# EAGLE design controller (EAGLE 6.1)
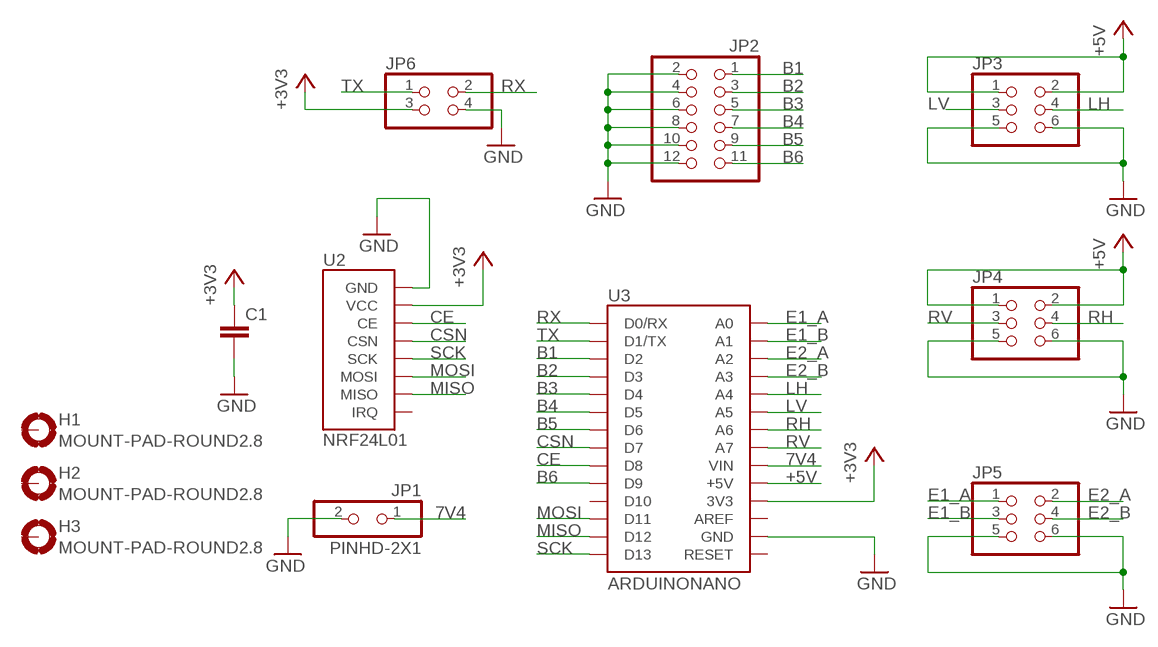
[diagram p0: schematic, sheet 1]

## Parts
C1  C-EUC0805  [C0805]
H1  MOUNT-PAD-ROUND2.8  [2,8-PAD]
H2  MOUNT-PAD-ROUND2.8  [2,8-PAD]
H3  MOUNT-PAD-ROUND2.8  [2,8-PAD]
JP1  PINHD-2X1  [2X01/90]
JP2  PINHD-2X6/90  [2X06/90]
JP3  PINHD-2X3/90  [2X03/90]
JP4  PINHD-2X3/90  [2X03/90]
JP5  PINHD-2X3/90  [2X03/90]
JP6  PINHD-2X2/90  [2X02/90]
U2  NRF24L01  [NRF24L01]
U3  ARDUINONANO  [PDIP-32]

## Nets
7V4: JP1.1 U3.VIN
+3V3: C1.1 JP6.3 U2.2(VCC) U3.3V3
+5V: JP3.1 JP3.2 JP4.1 JP4.2 U3.+5V
B1: JP2.1 U3.D2
B2: JP2.3 U3.D3
B3: JP2.5 U3.D4
B4: JP2.7 U3.D5
B5: JP2.9 U3.D6
B6: JP2.11 U3.D9
CE: U2.3(CE) U3.D8
CSN: U2.4(CSN) U3.D7
E1_A: JP5.1 U3.A0
E1_B: JP5.3 U3.A1
E2_A: JP5.2 U3.A2
E2_B: JP5.4 U3.A3
GND: C1.2 JP1.2 JP2.2 JP2.4 JP2.6 JP2.8 JP2.10 JP2.12 JP3.5 JP3.6 JP4.5 JP4.6 JP5.5 JP5.6 JP6.4 U2.1(GND) U3.GND U3.GND1(GND)
LH: JP3.4 U3.A4
LV: JP3.3 U3.A5
MISO: U2.7(MISO) U3.D12
MOSI: U2.6(MOSI) U3.D11
RH: JP4.4 U3.A6
RV: JP4.3 U3.A7
RX: JP6.2 U3.D0/RX
SCK: U2.5(SCK) U3.D13
TX: JP6.1 U3.D1/TX
Unconnected: H1.B2,8(MOUNT) H2.B2,8(MOUNT) H3.B2,8(MOUNT) U2.8(IRQ) U3.AREF U3.D10 U3.RESET U3.RESET1(RESET)

## Library data of the parts
C1 = rcl:C-EU: CAPACITOR, European symbol
H1-H3 = holes:MOUNT-PAD-ROUND: MOUNTING PAD, round
JP1 = pinhead:PINHD-2X1
JP2 = pinhead:PINHD-2X6: PIN HEADER
JP3-JP5 = pinhead:PINHD-2X3: PIN HEADER
JP6 = pinhead:PINHD-2X2: PIN HEADER
U2 = RF:NRF24L01
U3 = jet-lib:ARDUINONANO

## Board
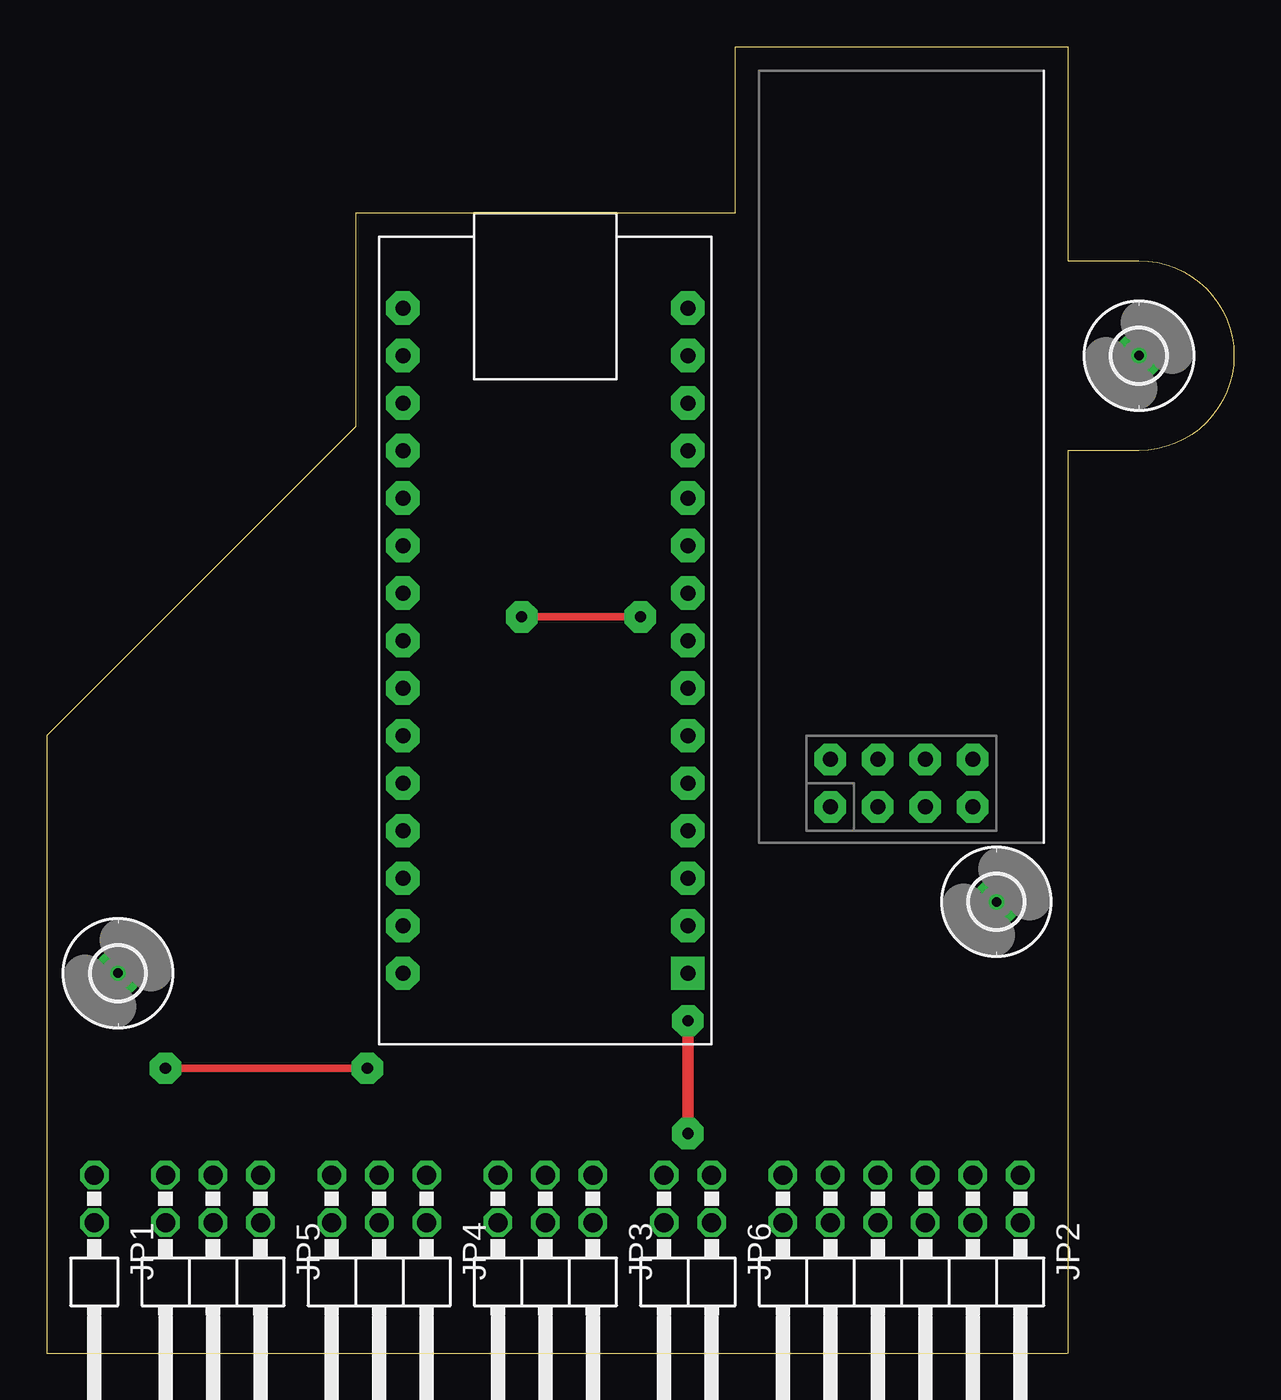
[diagram p1: board, top side]
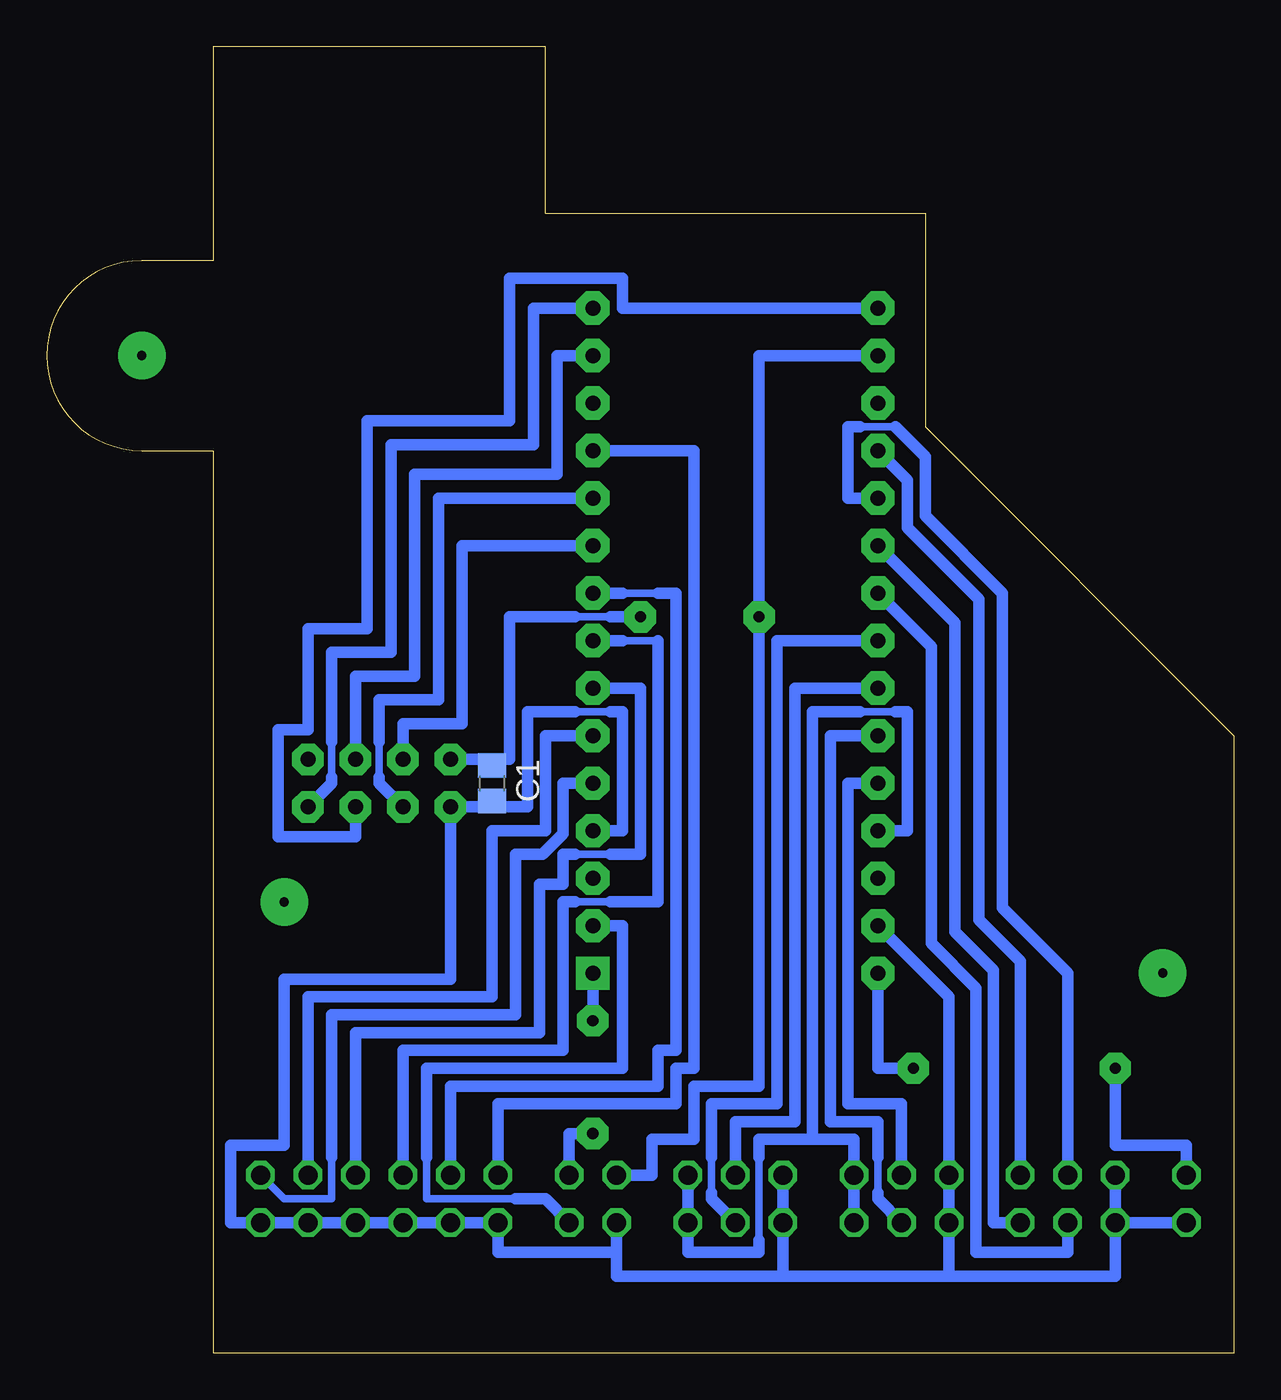
[diagram p2: board, bottom side, seen from below]

Size 63.5 x 69.85 mm. Coordinates in mm from the lower left corner, seen from the top.
Outline: 54.59,0 0,0 0,33.02 16.51,49.53 16.51,60.96 36.83,60.96 36.83,69.85 54.61,69.85 54.61,58.42 58.42,58.42 arc-180 58.42,48.26 54.61,48.26 54.61,0
Copper layers (1*16): Top 0.035mm / dielectric 1.5mm / Bottom 0.035mm
Design rules: minimum track width 10mil, minimum drill 24mil, track to track 8mil, track to pad 8mil, pad to pad 8mil, via to via 8mil, smd to smd 8mil, copper to edge 40mil, drill to drill 8mil, minimum pad ring 10mil, minimum via ring 8mil, stop-mask expansion 4mil, vias tented up to drill 0mil, thermal gap 10mil

### Footprints (pad centres in the part's own frame; a part is rotated, then mirrored left to right if it is on the bottom)
C0805 = smd 1.3 x 1.5: 1 -0.95,0; 2 0.95,0
2,8-PAD = drill 0.5 pad 2.54: B2,8 0,0
2X01/90 = drill 1.016 octagon: 1 0,-6.35; 2 0,-3.81
2X06/90 = drill 1.016 octagon: 1 -6.35,-6.35; 2 -6.35,-3.81; 3 -3.81,-6.35; 4 -3.81,-3.81; 5 -1.27,-6.35; 6 -1.27,-3.81; 7 1.27,-6.35; 8 1.27,-3.81; 9 3.81,-6.35; 10 3.81,-3.81; 11 6.35,-6.35; 12 6.35,-3.81
2X03/90 = drill 1.016 octagon: 1 -2.54,-6.35; 2 -2.54,-3.81; 3 0,-6.35; 4 0,-3.81; 5 2.54,-6.35; 6 2.54,-3.81
2X02/90 = drill 1.016 octagon: 1 -1.27,-6.35; 2 -1.27,-3.81; 3 1.27,-6.35; 4 1.27,-3.81
NRF24L01 = drill 0.8 pad 1.676 octagon: 1 19.05,-3.81; 2 16.51,-3.81; 3 19.05,-1.27; 4 16.51,-1.27; 5 19.05,1.27; 6 16.51,1.27; 7 19.05,3.81; 8 16.51,3.81
PDIP-32 = drill 0.8 pad 1.778 octagon: 3V3 15.24,-35.56; +5V 15.24,-10.16; A0 15.24,-30.48; A1 15.24,-27.94; A2 15.24,-25.4; A3 15.24,-22.86; A4 15.24,-20.32; A5 15.24,-17.78; A6 15.24,-15.24; A7 15.24,-12.7; AREF 15.24,-33.02; D0/RX 0,-5.08; D2 0,-12.7; D3 0,-15.24; D4 0,-17.78; D5 0,-20.32; D6 0,-22.86; D7 0,-25.4; D8 0,-27.94; D9 0,-30.48; D10 0,-33.02; D11 0,-35.56; D12 0,-38.1; D13 15.24,-38.1; GND 0,-10.16; GND1 15.24,-5.08; RESET 0,-7.62; RESET1 15.24,-7.62; VIN 15.24,-2.54 | drill 0.8 pad 1.778 square: D1/TX 0,-2.54

### Placement (x,y rotation side)
C1  39.69,30.48 270 bottom
H1  3.81,20.32 0 top
H2  50.8,24.13 0 top
H3  58.42,53.34 0 top
JP1  2.54,3.17 180 top
JP2  45.72,3.17 180 top
JP3  26.67,3.17 180 top
JP4  17.78,3.17 180 top
JP5  8.89,3.17 180 top
JP6  34.29,3.17 180 top
U2  45.72,48.26 270 top
U3  34.29,17.78 180 top

### Tracks (layer width: path | path; a pad name or v marks a point on that pad's centre or on a via)
7V4  (via drill 0.6 pad 1.68)
  Top 0.406: v6.35,15.24 v17.14,15.24
  Bottom 0.61: JP1.1 2.54,11.11 6.35,11.11 v6.35,15.24 | v17.14,15.24 19.05,15.24 U3.VIN
+3V3  (via drill 0.6 pad 1.68)
  Top 0.406: v31.75,39.37 v25.4,39.37
  Bottom 0.406: 35.24,39.37 33.34,39.37
  Bottom 0.61: U3.3V3 25.4,53.34 v25.4,39.37 25.4,14.29 28.89,14.29 28.89,11.43 31.11,11.43 31.11,9.53 JP6.3 | 35.24,39.37 38.73,39.37 38.73,31.75 39.69,31.75 | 33.34,39.37 v31.75,39.37 | C1.1 39.69,31.75 | 39.69,31.75 U2.2
+5V
  Bottom 0.406: 18.1,34.29 20,34.29 | 25.4,10.48 25.4,6.03
  Bottom 0.61: 22.54,11.43 25.4,11.43 25.4,10.48 | U3.+5V 17.46,27.94 17.46,34.29 18.1,34.29 | 20,34.29 22.54,34.29 22.54,11.43 | 22.54,11.43 20.32,11.43 JP4.1 JP4.2 | JP3.1 JP3.2 29.21,5.4 25.4,5.4 25.4,6.03
B1
  Bottom 0.406: 48.26,10.48 48.26,8.26 50.8,8.26 JP2.1
  Bottom 0.61: U3.D2 35.88,30.48 35.88,27.78 36.99,26.67 38.42,26.67 38.42,18.1 48.26,18.1 48.26,10.48
B2
  Bottom 0.61: U3.D3 36.83,33.02 36.83,27.94 39.69,27.94 39.69,19.05 49.53,19.05 JP2.3
B3
  Bottom 0.406: 35.24,26.67 33.34,26.67
  Bottom 0.61: U3.D4 31.75,35.56 31.75,26.67 33.34,26.67 | JP2.5 46.99,17.14 37.15,17.14 37.15,25.08 35.88,25.08 35.88,26.67 35.24,26.67
B4
  Bottom 0.406: 33.34,24.13 35.24,24.13 | 32.7,38.1 30.8,38.1
  Bottom 0.61: 33.34,24.13 30.8,24.13 30.8,38.1 | 35.24,24.13 35.88,24.13 35.88,16.19 44.45,16.19 JP2.7 | U3.D5 32.7,38.1
B5
  Bottom 0.406: 32.7,40.64 30.8,40.64
  Bottom 0.61: U3.D6 32.7,40.64 | 30.8,40.64 29.84,40.64 29.84,16.19 30.8,16.19 30.8,14.29 41.91,14.29 JP2.9
B6
  Bottom 0.61: U3.D9 28.89,48.26 28.89,15.24 29.84,15.24 29.84,13.34 39.37,13.34 JP2.11
CE
  Bottom 0.406: 45.72,30.8 45.72,32.7
  Bottom 0.61: U2.3 45.72,30.48 45.72,30.8 | 45.72,32.7 45.72,34.92 42.55,34.92 42.55,45.72 U3.D8
CSN
  Bottom 0.61: U3.D7 41.27,43.18 41.27,33.66 44.45,33.66 U2.4
E1_A
  Bottom 0.61: JP5.1 11.43,20.95 13.65,23.18 13.65,40.32 17.46,44.13 17.46,46.67 U3.A0
E1_B
  Bottom 0.406: 20,49.53 18.1,49.53
  Bottom 0.61: U3.A1 20.64,45.72 20.64,49.53 20,49.53 | 18.1,49.53 16.51,47.94 16.51,44.77 12.38,40.64 12.38,23.81 8.89,20.32 JP5.3
E2_A
  Bottom 0.61: U3.A2 14.92,39.05 14.92,22.54 12.86,20.48 12.86,6.99 JP5.2
E2_B
  Bottom 0.61: U3.A3 16.19,37.78 16.19,21.91 13.81,19.53 13.81,5.4 8.89,5.4 JP5.4
GND
  Bottom 0.406: 35.24,34.29 33.34,34.29
  Bottom 0.61: U3.GND 32.7,27.94 32.7,34.29 33.34,34.29 | 35.24,34.29 37.78,34.29 37.78,29.21 39.69,29.21 | U3.GND1 15.24,19.05 JP4.5 JP4.6 15.24,4.13 | JP5.6 JP1.2 | JP5.6 JP5.5 | 15.24,4.13 6.35,4.13 JP5.6 | JP3.5 JP3.6 24.13,4.13 | 24.13,4.13 33.02,4.13 33.02,5.4 | 24.13,4.13 15.24,4.13 | JP6.4 33.02,5.4 | 33.02,5.4 39.37,5.4 JP2.12 JP2.10 JP2.8 JP2.6 JP2.4 JP2.2 53.66,6.99 53.66,11.11 50.8,11.11 50.8,20 41.91,20 U2.1 39.69,29.21 | C1.2 39.69,29.21
LH
  Bottom 0.406: 27.94,10.48 27.94,8.57
  Bottom 0.61: U3.A4 24.45,38.1 24.45,13.34 27.94,13.34 27.94,10.48 | JP3.4 27.94,8.26 27.94,8.57
LV
  Bottom 0.61: U3.A5 23.5,35.56 23.5,12.38 26.67,12.38 JP3.3
MISO
  Bottom 0.406: 48.26,30.8 48.26,32.7
  Bottom 0.61: U2.7 48.26,30.48 48.26,30.8 | 48.26,32.7 48.26,37.47 45.09,37.47 45.09,48.58 37.47,48.58 37.47,55.88 U3.D12
MOSI
  Bottom 0.61: U2.6 46.99,36.2 43.81,36.2 43.81,46.99 36.2,46.99 36.2,53.34 U3.D11
RH
  Bottom 0.406: 19.05,10.48 19.05,8.57
  Bottom 0.61: U3.A6 21.59,33.02 21.59,12.38 19.05,12.38 19.05,10.48 | JP4.4 19.05,8.26 19.05,8.57
RV
  Bottom 0.61: U3.A7 20.64,30.48 20.64,13.34 17.78,13.34 JP4.3
RX
  Bottom 0.406: 43.18,10.48 43.18,8.26 38.42,8.26
  Bottom 0.61: U3.D0/RX 32.7,22.86 32.7,15.24 43.18,15.24 43.18,10.48 | 38.42,8.26 36.83,8.26 JP6.2
SCK
  Bottom 0.61: U3.D13 32.7,55.88 32.7,57.47 38.73,57.47 38.73,49.85 46.35,49.85 46.35,38.73 49.53,38.73 49.53,33.34 51.12,33.34 51.12,27.62 46.99,27.62 U2.5
TX  (via drill 0.6 pad 1.68)
  Top 0.61: v34.29,11.75 v34.29,17.78
  Bottom 0.61: JP6.1 35.56,11.75 v34.29,11.75 | v34.29,17.78 U3.D1/TX